# Altium project dian_recruitment_2022_V1.PrjPcb
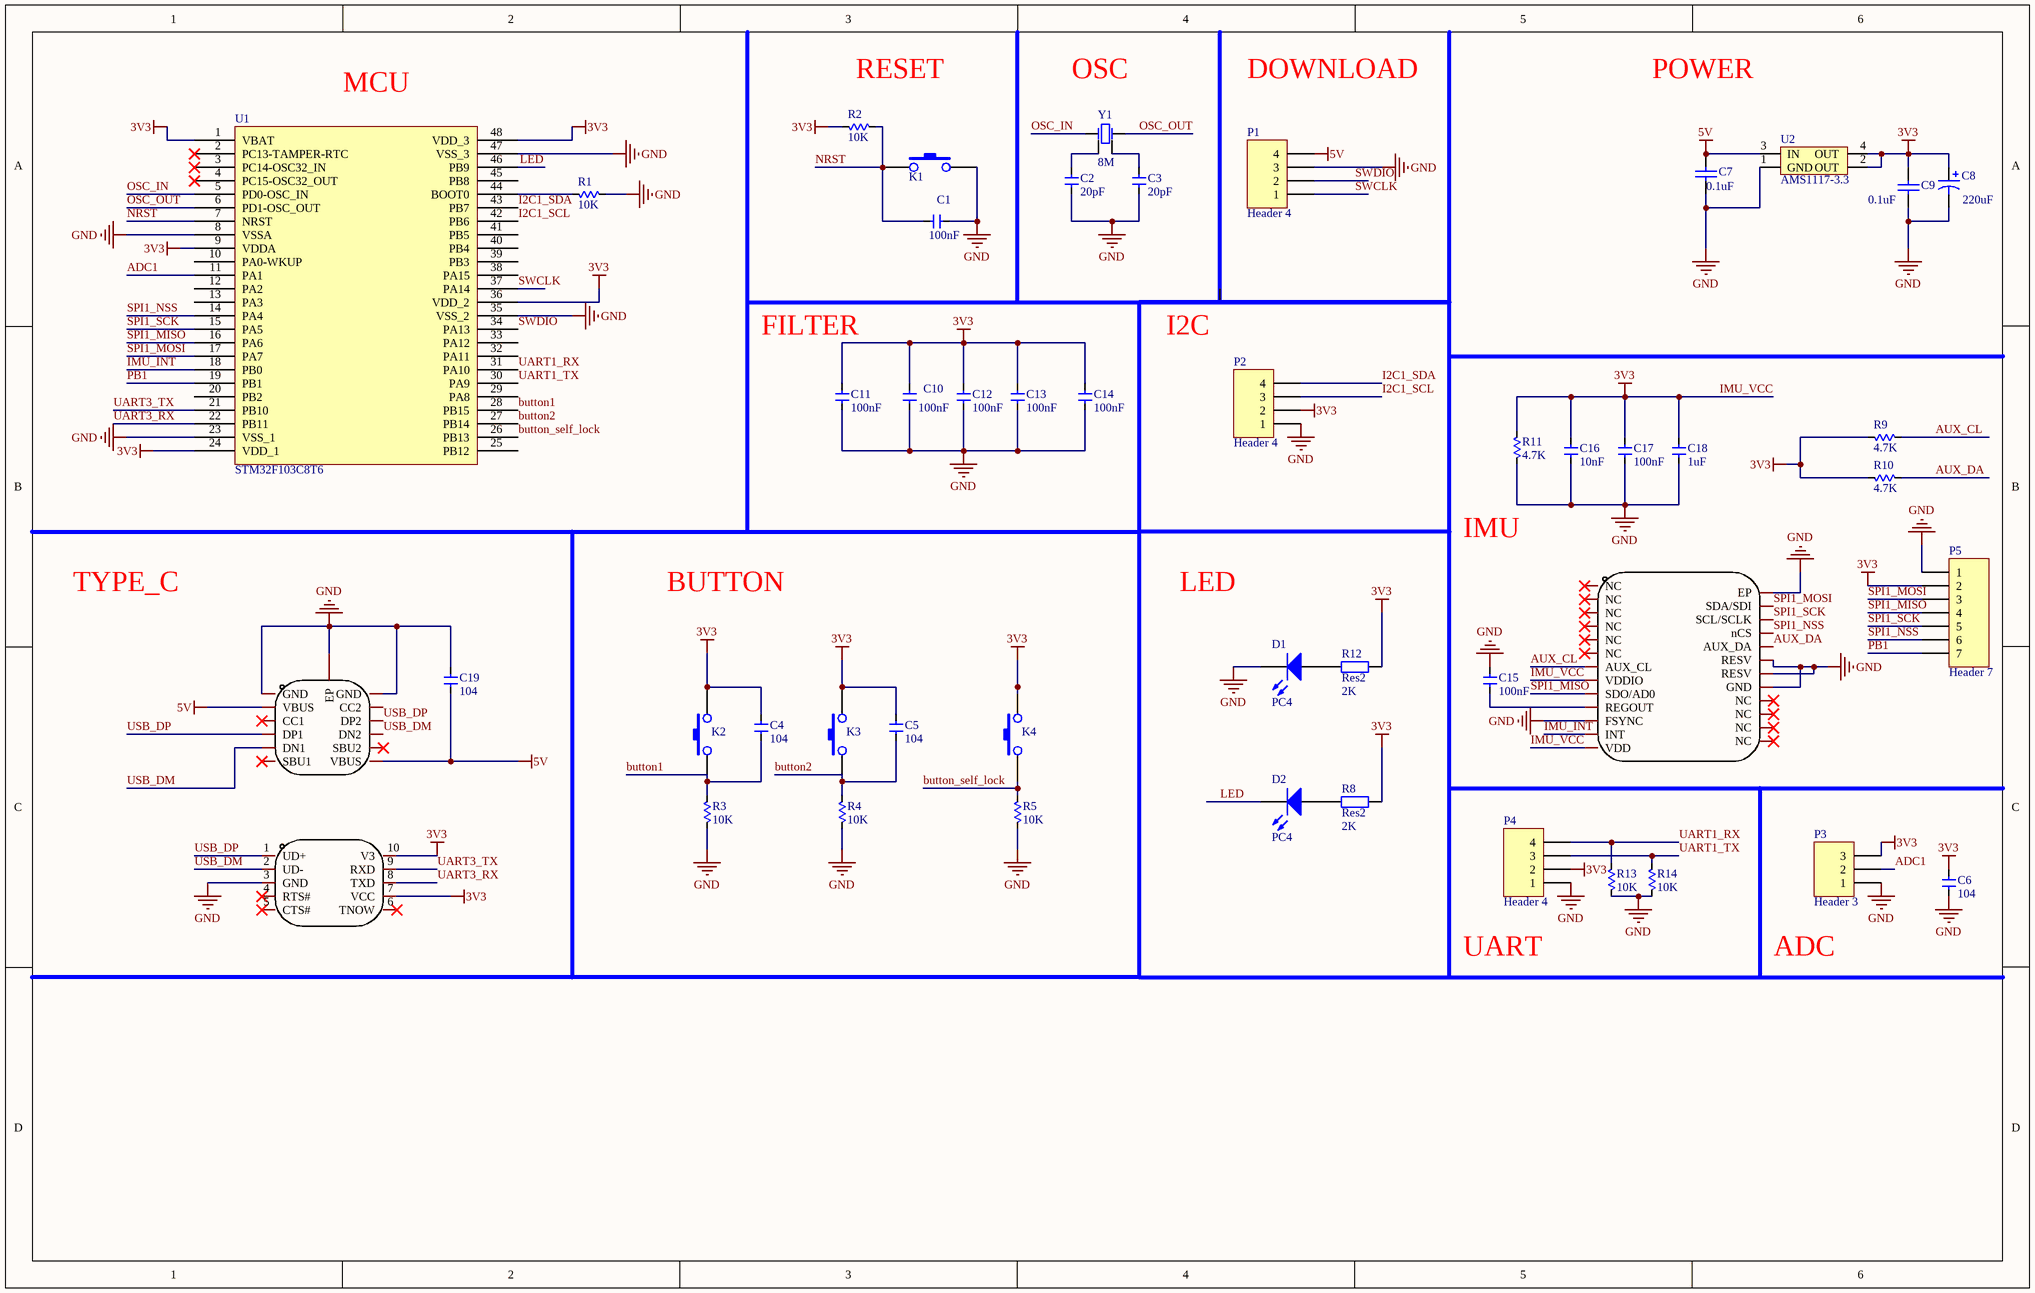
[diagram p0: dian_recruitment_2022_V1.SchDoc]
1 sheet, 48 parts. Net scope: global (net labels, ports and power ports of the same name join across sheets).
Board file: dian_recruitment_2022_V1.PcbDoc

## Sheet dian_recruitment_2022_V1.SchDoc
size 381 x 241 mm; SheetNumber: 1; SheetTotal: 1

### Parts
C1  100nF  [0603_C]
C2  20pF  [0603_C]
C3  20pF  [0603_C]
C4  104  [0603_C]
C5  104  [0603_C]
C6  104  [0603_C]
C7  0.1uF  [0603_C]
C8  220uF  [CTan-A]
C9  0.1uF  [0603_C]
C10  100nF  [0603_C]
C11  100nF  [0603_C]
C12  100nF  [0603_C]
C13  100nF  [0603_C]
C14  100nF  [0603_C]
C15  100nF  [0603_C]
C16  10nF  [0603_C]
C17  100nF  [0603_C]
C18  1uF  [0603_C]
C19  104  [0603_C]
D1  PC4  [0603_LED_RED]
D2  PC4  [0603_LED_RED]
K1  NRST  [KEY-4.5*4.5mm]  (value not drawn)
K2  PB13  [KEY-4.5*4.5mm]  (value not drawn)
K3  PB13  [KEY-4.5*4.5mm]  (value not drawn)
K4  PB13  [key]  (value not drawn)
P1  Header 4  [HDR1X4]
P2  Header 4  [HDR1X4]
P3  Header 3  [HDR1X3]
P4  Header 4  [HDR1X4]
P5  Header 7  [HDR1X7]
R1  10K  [0603_R]
R2  10K  [0603_R]
R3  10K  [0603_R]
R4  10K  [0603_R]
R5  10K  [0603_R]
R8  Res2  value 2K  [0603_R]
R9  4.7K  [0603_R]
R10  4.7K  [0603_R]
R11  4.7K  [0603_R]
R12  Res2  value 2K  [0603_R]
R13  10K  [0603_R]
R14  10K  [0603_R]
U1  STM32F103C8T6  [LQFP-48P]
U2  AMS1117-3.3  [SOT-223]
U3  MPU6500  [QFN24]  (value not drawn)
USB1  TYPEC-304-ACP16  [USB_TYPEC]  (value not drawn)
Y1  8M  [XTAL-3225]
  (no value)  [MSOP-10P[0.5]]

### Nets
5V: C7.2 C19.2 P1.4 U2.3(IN) USB1.A4B9(VBUS) USB1.B4A9(VBUS)
GND: C1.2 C2.2 C3.2 C6.2 C7.1 C8.2 C9.1 C10.2 C11.2 C12.2 C13.2 C14.2 C15.1 C16.2 C17.2 C18.2 C19.1 D1.K K1.2 P1.3 P2.1 P3.1 P4.1 P5.1 R1.1 R3.2 R4.2 R5.2 R11.2 R13.2 R14.2 U1.8(VSSA) U1.23(VSS_1) U1.35(VSS_2) U1.47(VSS_3) U2.1(GND) U3.11(FSYNC) U3.18(GND) U3.19(RESV) U3.20(RESV) U3.25(EP) USB1.A1B12(GND) USB1.B1A12(GND) USB1.EP .3(GND)
IMU_VCC: C4.1 C5.1 C6.1 C8.1 C9.2 C10.1 C11.1 C12.1 C13.1 C14.1 C16.1 C17.1 C18.1 K2.1 K3.1 K4.1 P2.2 P3.3 P4.2 P5.2 R2.2 R8.2 R9.2 R10.2 R11.1 R12.2 U1.1(VBAT) U1.9(VDDA) U1.24(VDD_1) U1.36(VDD_2) U1.48(VDD_3) U2.2(OUT) U2.4(OUT) U3.8(VDDIO) U3.13(VDD) .7(VCC) .10(V3)  [also labelled 3V3]
ADC1: P3.2 U1.11(PA1)
AUX_CL: R9.1 U3.7(AUX_CL)
AUX_DA: R10.1 U3.21(AUX_DA)
button1: C4.2 K2.2 R3.1 U1.28(PB15)
button2: C5.2 K3.2 R4.1 U1.27(PB14)
button_self_lock: K4.2 R5.1 U1.26(PB13)
I2C1_SCL: P2.3 U1.42(PB6)
I2C1_SDA: P2.4 U1.43(PB7)
IMU_INT: U1.18(PB0) U3.12(INT)
LED: D2.K U1.46(PB9)
NRST: C1.1 K1.1 R2.1 U1.7(NRST)
OSC_IN: U1.5(PD0-OSC_IN) Y1.1(OSC1)
OSC_OUT: U1.6(PD1-OSC_OUT) Y1.3(OSC2)
PB1: P5.7 U1.19(PB1)
SPI1_MISO: P5.4 U1.16(PA6) U3.9(SDO/AD0)
SPI1_MOSI: P5.3 U1.17(PA7) U3.24(SDA/SDI)
SPI1_NSS: P5.6 U1.14(PA4) U3.22(nCS)
SPI1_SCK: P5.5 U1.15(PA5) U3.23(SCL/SCLK)
SWCLK: P1.1 U1.37(PA14)
SWDIO: P1.2 U1.34(PA13)
UART1_RX: P4.4 R13.1 U1.31(PA10)
UART1_TX: P4.3 R14.1 U1.30(PA9)
UART3_RX: U1.22(PB11) .8(TXD)
UART3_TX: U1.21(PB10) .9(RXD)
USB_DM: USB1.A7(DN1) USB1.B7(DN2) .2(UD-)
USB_DP: USB1.A6(DP1) USB1.B6(DP2) .1(UD+)
NetC2_1: C2.1 Y1.2(GND)
NetC3_1: C3.1 Y1.4(GND)
NetC15_2: C15.2 U3.10(REGOUT)
NetD1_A: D1.A R12.1
NetD2_A: D2.A R8.1
NetR1_2: R1.2 U1.44(BOOT0)

Not connected (* = marked no-connect by the designer): U1 2(PC13-TAMPER-RTC)* 3(PC14-OSC32_IN)* 4(PC15-OSC32_OUT)* 10(PA0-WKUP) 12(PA2) 13(PA3) 20(PB2) 25(PB12) 29(PA8) 32(PA11) 33(PA12) 38(PA15) 39(PB3) 40(PB4) 41(PB5) 45(PB8); U3 1(NC)* 2(NC)* 3(NC)* 4(NC)* 5(NC)* 6(NC)* 14(NC)* 15(NC)* 16(NC)* 17(NC)*; USB1 A5(CC1)* A8(SBU1)* B5(CC2) B8(SBU2)*;  4(RTS#)* 5(CTS#)* 6(TNOW)*

### Notes on the sheet
- (near U1) MCU
- (near R2) RESET
- (near Y1) OSC
- DOWNLOAD
- POWER
- (near C11) FILTER
- I2C
- IMU
- TYPE_C
- BUTTON
- LED
- (near P4) UART
- ADC

### Library data of the parts
C1 C4-C6 C10-C19 = Capacitor
C2 C3 = Capacitor_6
C7 C9 = Cap: Capacitor; Published: 8-Jun-2000; LatestRevisionDate: 17-Jul-2002; LatestRevisionNote: Re-released for DXP Platform.; PackageReference: RAD-0.3; Publisher: Altium Limited; PackageDescription: Radial Cap, Thru-Hole; 2 Leads; 0.3 in Pin Spacing; Value: 0.1uF
C8 = Cap Pol1: Polarized Capacitor (Radial); Published: 8-Jun-2000; LatestRevisionDate: 17-Jul-2002; LatestRevisionNote: Re-released for DXP Platform.; PackageReference: RB7.6-15; Publisher: Altium Limited; PackageDescription: Polarized Capacitor (Radial); 2 Leads; Value: 220uF
D1 D2 = 0603 蓝灯: 发光二极管; pin to pad: A>1 K>2; ComponentLink1Description: 供应商链接; ComponentLink1URL: http://www.szlcsc.com/product/details_73150.html; Package: 0603; Supplier: LC; SuppliersPartNumber: C72041
K1-K3 = KEY: KEY_SWI; pin to pad: 2>3; Manufacturer: HYP; Assembly: SMD; Value: 1TS002E-2500-2501-CT_3*6*2.5_SMD2.5; Marking: *; Price_Sample: 2.03; Code: *; Type: SWI; Certification: *; Price_Batch: 2.03
K4 = KEY: KEY_SWI; Manufacturer: HYP; Assembly: SMD; Value: 1TS002E-2500-2501-CT_3*6*2.5_SMD2.5; Marking: *; Price_Sample: 2.03; Code: *; Type: SWI; Certification: *; Price_Batch: 2.03
P1 P2 P4 = Header 4: Header, 4-Pin; LatestRevisionDate: 17-Jul-2002; LatestRevisionNote: Re-released for DXP Platform.; Publisher: Altium Limited
P3 = Header 3: Header, 3-Pin; LatestRevisionDate: 17-Jul-2002; LatestRevisionNote: Re-released for DXP Platform.; Publisher: Altium Limited
P5 = Header 7: Header, 7-Pin; LatestRevisionDate: 17-Jul-2002; LatestRevisionNote: Re-released for DXP Platform.; Publisher: Altium Limited
R1-R5 R9-R11 R13 R14 = Resistor
R8 R12 = Res2: Resistor; Published: 8-Jun-2000; LatestRevisionDate: 17-Jul-2002; LatestRevisionNote: Re-released for DXP Platform.; PackageReference: AXIAL-0.4; Publisher: Altium Limited; PackageDescription: Axial Device, Thru-Hole; 2 Leads; 0.4 in Pin Spacing
U2 = AMS1117
U3 = MPU6500: Manufacturer: TDK InvenSense(应美盛); Add into BOM: yes; Name: MPU6500; Symbol: MPU6500; Device: MPU6500; LCSC Part Name: MPU6500; Supplier Part: C50278; Manufacturer Part: MPU6500; Supplier Footprint: QFN-24; JLCPCB Part Class: Extended Part; Datasheet: https://atta.szlcsc.com/upload/public/pdf/source/20170505/1493957890595.pdf; Supplier: LCSC; Convert to PCB: yes
USB1 = TYPEC-304-ACP16: Manufacturer: XUNPU(讯普); Add into BOM: yes; Connector Type: Type-C; Gender: 母座; Number of Contacts: 16; Number of Ports: 1; Current Rating - Power (Max): 3A; Name: TYPEC-304-ACP16; Symbol: TYPEC-304-ACP16; Device: TYPEC-304-ACP16; LCSC Part Name: Type-C 母座 卧贴; Supplier Part: C2982555; Manufacturer Part: TYPEC-304-ACP16; Supplier Footprint: SMD; JLCPCB Part Class: Extended Part; Datasheet: https://atta.szlcsc.com/upload/public/pdf/source/20220311/3C907F75E12F45E4EE7F73565AB9C294.pdf; Supplier: LCSC; Convert to PCB: yes; Mounting Style: 卧贴; Operating Temperature Range: -40℃~+85℃
Y1 = XTAL_4P: Crystal Oscillator; Manufacturer: EPS; Assembly: SMD; Value: 1C208000CE0R_SMD-3225_4P_SMD0.85; Type: CY
 = CH340E: Manufacturer: WCH(南京沁恒); Add into BOM: yes; Protocol: USB 2.0; Data Rate: 2Mbps; Supply Voltage: 3.3V, 5V